# EasyEDA Pro project ProPrj_SRC_Robot2025_V1.0_2026-09-06.epro, board PCB-MOTOR
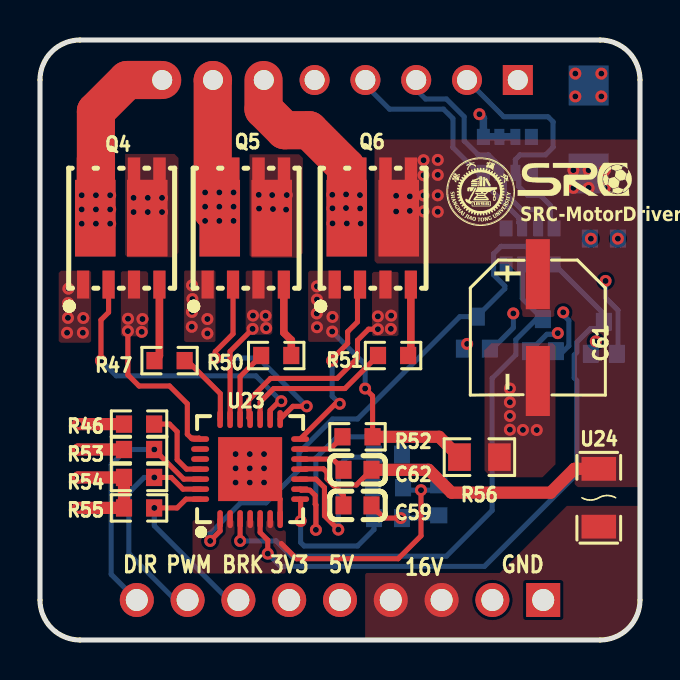
[diagram p11: board, top side]
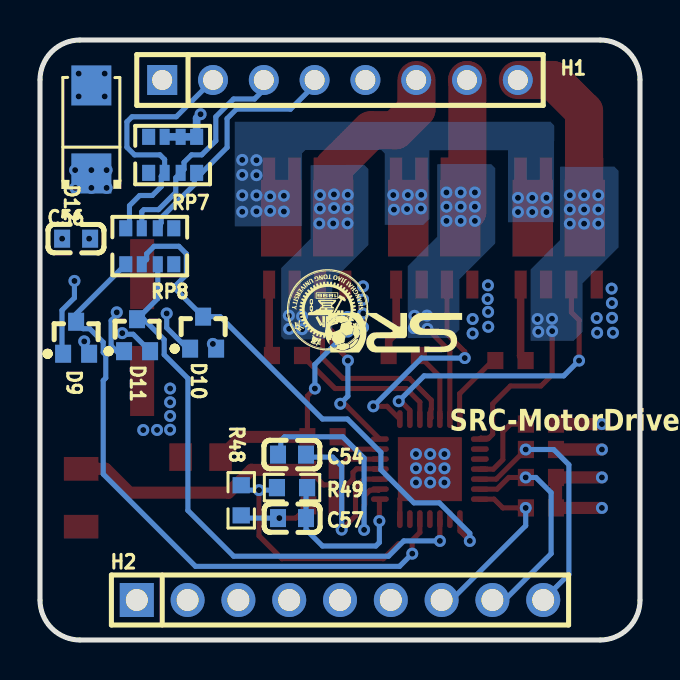
[diagram p12: board, bottom side, seen from below]

Outline 30 x 30 mm; copper layers: Top Layer, Mid-Layer 1, Mid-Layer 2, Bottom Layer. Coordinates in mm from the lower left corner of the outline.
Outline path: 0,28 0,2 arc(0.59,0.59) 2,0 28,0 arc(29.41,0.59) 30,2 30,28 arc(29.41,29.41) 28,30 2,30 arc(0.59,29.41) 0,28
Stack: Top Layer 0.035mm 外层铜厚1oz / Dielectric1 0.2104mm 7628 RC49% 8.6mil / Mid-Layer 1 0.0152mm 内层铜厚 / Dielectric2 1.065mm 1.1mm H/HOZ Copper / Mid-Layer 2 0.0152mm 内层铜厚 / Dielectric3 0.2104mm 7628 RC49% 8.6mil / Bottom Layer 0.035mm 外层铜厚1oz

## Design rules (mm)
net C56: Sheet3
net C58: Sheet3
net D8: Sheet3
net J10: Sheet3
net Q4: Sheet3
net Q5: Sheet3
net R47: Sheet3
net R50: Sheet3
net R51: Sheet3
net R52: Sheet3
net R56: Sheet3
net RP7: Sheet3
net RP8: Sheet3
net TP14: Sheet3
net TP15: Sheet3
net TP16: Sheet3
net TP17: Sheet3
net TP18: Sheet3
net TP19: Sheet3
net U24: Sheet3
net U23: Top Side Components
net R46: Top Side Components
net R53: Top Side Components
net R54: Top Side Components
net R55: Top Side Components
net R48: Top Side Components
net R49: Top Side Components
net C54: Top Side Components
net C55: Top Side Components
net C57: Top Side Components
net C60: Top Side Components
net C59: Top Side Components
template: 用户自定义配置
spacing Clearance (default): track to track 0.127, other pairs 0 to 0.254
track width Width (default): min 0.025, default 0.254, max 100
differential pair DiffPairsRouting (default): width min 0.381, default 0.381, max 0.381; gap min 0.254, default 0.254
via RoutingVias (default): diameter min 0.406, default 1.27, max 1.27; hole min 0.203, default 0.711, max 0.711

## Placement (name value [footprint] x y rotation side)
C54  100pF  [C0603]  17.4 9.27 180 bottom
C56  100pF  [C0603]  28.19 20.07 180 bottom
C57  100pF  [C0603]  17.4 6.1 0 bottom
C59  4.7uF  [C0603]  15.88 6.73 0 top
C61  220uF  [CAP-SMD_BD6.3-L6.6-W6.6-LS7.8-FD]  24.89 15.62 270 top
C62  100nF  [C0603]  15.88 8.51 0 top
D9  BAV99W,115  [SOT-323_L2.0-W1.3-P1.30-LS2.1-BR]  28.19 15.11 270 bottom
D10  BAV99W,115  [SOT-323_L2.0-W1.3-P1.30-LS2.1-BR]  21.84 15.37 270 bottom
D11  BAV99W,115  [SOT-323_L2.0-W1.3-P1.30-LS2.1-BR]  25.15 15.24 270 bottom
D12  SMAJ18A  [SMA_L4.3-W2.6-LS5.1-RD]  27.43 25.53 90 bottom
H1  PZ254V-11-08P  [HDR-TH_8P-P2.54-V-M]  15 28 180 bottom
H2  PZ254V-11-09P  [HDR-TH_9P-P2.54-V-M]  15 2 180 bottom
Q4  AON6884  [DFN-8_L5.5-W5.2-P1.27-LS6.0-BL-EP2]  4.06 19.43 0 top
Q5  AON6884  [DFN-8_L5.5-W5.2-P1.27-LS6.0-BL-EP2]  10.29 19.43 0 top
Q6  AON6884  [DFN-8_L5.5-W5.2-P1.27-LS6.0-BL-EP2]  16.64 19.43 0 top
R46  1K  [R0603]  4.95 10.8 180 top
R47  1K  [R0603]  6.48 13.97 180 top
R48  1K  [R0603]  19.94 6.98 270 bottom
R49  1K  [R0603]  17.4 7.62 180 bottom
R50  1K  [R0603]  11.81 14.22 0 top
R51  1K  [R0603]  17.65 14.22 0 top
R52  1K  [R0603]  15.88 10.16 0 top
R53  1K  [R0603]  4.95 9.53 180 top
R54  1K  [R0603]  4.95 8.13 180 top
R55  1K  [R0603]  4.95 6.6 180 top
R56  1K  [R0805]  21.97 9.14 0 top
RP7  5.1kΩ  [RES-ARRAY-SMD_0603-8P-L3.2-W1.6-BL]  23.37 24.26 0 bottom
RP8  330Ω  [RES-ARRAY-SMD_0603-8P-L3.2-W1.6-BL]  24.51 19.69 180 bottom
U23  A4931METTR-T  [WQFN-28_L5.0-W5.0-P0.50-BL-EP3.2]  10.51 8.55 0 top
U24  0466004.NRHF  [F1206]  27.94 7.11 270 top

## Footprints (pads in the part's own frame, mm; a bottom-side part is the same pattern mirrored in y, then rotated)
C0603
  rect 0.8x0.9 smd: 1(-0.7,0) 2(0.7,0)
CAP-SMD_BD6.3-L6.6-W6.6-LS7.8-FD
  rect 3.5x1.2 smd: 1(-2.67,0) 2(2.67,0)
DFN-8_L5.5-W5.2-P1.27-LS6.0-BL-EP2
  rect 0.61x1.397 smd: 1(-1.905,-1.66) 2(-0.635,-1.66) 3(0.635,-1.66) 4(1.905,-1.66)
  custom 2.028x4.953 smd: 5(1.3,1.66) 6(-1.3,1.66)
F1206
  rect 1.19x1.728 smd: 1(-1.445,0) 2(1.445,0)
HDR-TH_8P-P2.54-V-M
  rect 1.5x1.5 hole 1: 1(-8.89,0)
  round 1.5 hole 1: 2(-6.35,0) 3(-3.81,0) 4(-1.27,0) 5(1.27,0) 6(3.81,0) 7(6.35,0) 8(8.89,0)
HDR-TH_9P-P2.54-V-M
  rect 1.7x1.7 hole 1.1: 1(-10.16,0)
  round 1.7 hole 1.1: 2(-7.62,0) 3(-5.08,0) 4(-2.54,0) 5(0,0) 6(2.54,0) 7(5.08,0) 8(7.62,0) 9(10.16,0)
R0603
  rect 0.806x0.864 smd: 1(-0.753,0) 2(0.753,0)
R0805
  rect 1.133x1.377 smd: 1(-1,0) 2(1,0)
RES-ARRAY-SMD_0603-8P-L3.2-W1.6-BL
  rect 0.65x0.8 smd: 1(-1.2,-0.9) 4(1.2,-0.9) 5(1.2,0.9) 8(-1.2,0.9)
  rect 0.5x0.8 smd: 2(-0.4,-0.9) 3(0.4,-0.9) 6(0.4,0.9) 7(-0.4,0.9)
SMA_L4.3-W2.6-LS5.1-RD
  rect 2x2 smd: 1(-2.2,0) 2(2.2,0)
SOT-323_L2.0-W1.3-P1.30-LS2.1-BR
  rect 0.9x0.8 smd: 1(0.8,-0.65) 2(0.8,0.65) 3(-0.8,0)
WQFN-28_L5.0-W5.0-P0.50-BL-EP3.2
  oval 0.28x0.9 smd: 1(-1.502,-2.5) 2(-1.001,-2.5) 3(-0.5,-2.5) 4(0,-2.5) 5(0.5,-2.5) 6(1,-2.5) 7(1.501,-2.5) 15(1.501,2.5) 16(1,2.5) 17(0.5,2.5) 18(0,2.5) 19(-0.5,2.5) 20(-1.001,2.5) 21(-1.502,2.5)
  oval 0.9x0.28 smd: 8(2.5,-1.502) 9(2.5,-1.001) 10(2.5,-0.5) 11(2.5,0) 12(2.5,0.5) 13(2.5,1) 14(2.5,1.501) 22(-2.5,1.501) 23(-2.5,1) 24(-2.5,0.5) 25(-2.5,0) 26(-2.5,-0.5) 27(-2.5,-1.001) 28(-2.5,-1.502)
  rect 3.2x3.2 smd: 29(0,0)

## Nets
As in the schematic.

Pads without a net: RP7 4 5; RP8 4 5; U23 23 24

## Via types
v1: diameter 0.6, hole 0.3, Top Layer to Bottom Layer, 137 vias

## Routing (per net, layer and track width the routed paths; a pad name or vN(x,y) marks a point on that pad's centre or on a via; arc(x,y) is an arc through that point)
+3V3: length 6.1
  Top Layer w0.61: v1(1.91,8.13) R54.2 R55.2 v1(1.91,6.6)
+5V: length 4.6
  Bottom Layer w0.254: v1(25.89,15.34) 25.73,15.34 25.67,15.29 25.34,15.29 D11.2
  Bottom Layer w0.381: 23.77,25.16 22.17,25.16 22.17,26.09 v1(21.97,26.29)
  vias: v1(21.36,14.8) v1(27.79,14.93) v1(28.89,20.07)
GND: length 20.6
  Top Layer w0.254: U23.7 12.01,7.04 U23.29 ; C59.2 17.21,6.1 v1(18.03,6.1)
  Top Layer w0.61: R53.2 v1(1.91,9.53) ; R46.2 v1(1.91,10.8)
  Bottom Layer w0.254: 22.37,14.31 23.67,15.61 v1(23.67,16.33) ; R48.2 19.8,6.1 v1(18.03,6.1) ; v1(26.16,16.38) 26.16,16.26 26.44,15.97 26.44,14.71 26.05,14.31 25.67,14.31 ; v1(28.28,17.95) 28.28,17.11 28.9,16.49 28.9,14.37 D9.1
  vias: v1(9.78,9.3) v1(9.78,8.58) v1(9.78,7.87) v1(10.49,9.3) v1(10.49,8.58) v1(10.49,7.87) v1(11.2,9.3) v1(11.2,8.58) v1(11.2,7.87) v1(23.5,12.57) v1(23.5,11.89) v1(23.5,11.2) v1(23.5,10.52) v1(24.15,10.5) v1(24.84,10.5) v1(26.77,28.32) v1(26.77,27.18) v1(27.54,20.07) v1(28.07,28.32) v1(28.07,27.18)
A_OUT1: length 16.9
  Top Layer w0.254: v1(4.39,15.44) 4.39,13.26 4.95,12.7 6.48,12.7 7.37,11.81 7.37,10.29 7.59,10.06 7.62,10.09 7.96,10.09 U23.22
  Top Layer w1.905: v1(2.8,21.53) v1(2.8,22.24) 2.8,26.44 4.36,28 H1.8
  vias: v1(2.09,22.24) v1(2.09,21.53) v1(2.09,20.82) v1(2.8,20.82) v1(3.51,22.24) v1(3.51,21.53) v1(3.51,20.82) v1(4.4,16.06) v1(5.12,16.05) v1(5.09,15.41)
B_OUT1: length 12
  Top Layer w0.254: v1(10.63,15.56) 9.5,14.43 U23.20
  Top Layer w1.905: H1.7 8.64,27.99 8.64,21.44 Q5.6
  vias: v1(8.25,22.38) v1(8.25,21.67) v1(8.25,20.95) v1(8.97,22.38) v1(8.97,21.67) v1(8.97,20.95) v1(9.68,22.38) v1(9.68,21.67) v1(9.68,20.95) v1(10.65,16.22) v1(11.28,16.21) v1(11.31,15.59)
C_OUT1: length 18.3
  Top Layer w0.254: U23.18 10.45,11.1 10.45,11.54 10.43,11.56 10.43,11.99 11.53,13.08 14.86,13.08 15.88,14.1 15.88,14.99 16.43,15.54 v1(16.89,15.54)
  Top Layer w1.905: 11.18,28 11.18,26.54 12.23,25.49 13.45,25.49 15.3,23.64 v1(15.3,21.6)
  vias: v1(14.61,22.26) v1(14.62,21.59) v1(14.63,20.83) v1(15.3,22.28) v1(15.34,20.83) v1(16,22.25) v1(16.01,21.58) v1(16.04,20.82) v1(16.89,16.18) v1(17.54,15.56) v1(17.56,16.22)
HA_A1: length 26.9
  Top Layer w0.254: U23.1 9,5.45 v1(8.51,4.95)
  Bottom Layer w0.254: v1(8.51,4.95) 8.51,5.33 10.03,6.86 11.3,6.86 12.95,8.51 12.95,9.38 14.63,11.05 15.88,11.05 20.99,16.17 D10.3 23.24,17.56 23.24,17.7 22.68,18.26 22.68,19.31 23.06,19.69 24.29,19.69 24.67,19.31 24.67,19.03 RP8.2
HA_B1: length 28.9
  Top Layer w0.254: U23.3 v1(10.01,4.95)
  Bottom Layer w0.254: v1(10.01,4.95) 11.81,4.95 12.57,4.19 20.32,4.19 22.61,6.48 22.61,13.08 23.79,14.27 23.79,15.02 24.81,16.04 D11.3 24.11,17.08 RP8.3
HA_C1: length 31.9
  Top Layer w0.254: v1(11.39,4.32) 11.39,5 11.01,5.38 U23.5
  Bottom Layer w0.254: v1(11.39,4.32) 12.02,3.68 22.22,3.68 26.84,8.3 26.84,12.97 26.71,13.1 26.71,14.25 26.84,14.38 26.84,14.89 27.51,15.56 27.85,15.56 D9.3 28.19,16.3 25.71,18.78
MOTOR_BRK1: length 9.1
  Top Layer w0.254: U23.28 7.3,7.04 6.86,6.6 R55.1
  Bottom Layer w0.254: v1(5.72,6.6) 5.72,5.72 9.43,2 H2.7
MOTOR_DIR1: length 12.7
  Top Layer w0.254: R53.1 7.19,8.04 U23.26
  Bottom Layer w0.254: v1(5.72,9.53) 4.32,9.53 3.56,8.76 3.56,3.28 H2.9
MOTOR_PWM1: length 11.1
  Top Layer w0.254: R54.1 6.56,8.13 7.15,7.54 U23.27
  Bottom Layer w0.254: H2.8 6.76,2 4.44,4.32 4.44,7.37 5.21,8.13 v1(5.72,8.13)
$1N2: length 2.4
  Top Layer w0.254: C62.1 14.64,9.05 13.01,9.05
$1N4: length 12
  Top Layer w0.254: v1(19.05,7.49) 19.05,5.21 17.91,4.06 12.83,4.06 12.06,4.83
  Bottom Layer w0.254: R49.1 18.28,7.49 v1(19.05,7.49) 19.69,7.49 R48.1
$1N5: length 8.4
  Top Layer w0.254: U23.8 13.03,7.02 v1(13.03,5.95)
  Bottom Layer w0.254: v1(13.03,5.95) 13.03,4.87 13.21,4.7 15.88,4.7 16.7,5.52 C57.1 16.7,7.57 R49.2
$1N10: length 4
  Top Layer w0.254: R46.1 6.48,10.8 6.86,10.41 6.86,9.02 7.33,8.55 U23.25
$1N16: length 11.7
  Top Layer w0.254: v1(13.79,5.51) 13.79,6.76 13.76,6.79 13.76,7.23 13.5,7.49 13.06,7.49 U23.9
  Bottom Layer w0.254: v1(13.79,5.51) 13.79,9.1 14.86,10.16 17.78,10.16 17.96,9.98 17.96,9.41 C54.1
$1N17: length 9
  Top Layer w0.254: v1(14.92,5.52) 14.22,6.21 14.22,7.62 13.8,8.04 U23.10
  Bottom Layer w0.254: C54.2 16.57,9.14 15.37,9.14 14.92,8.69 v1(14.92,5.52)
$1N18: length 2.4
  Top Layer w0.254: R52.1 14.51,9.55 U23.13
$1N20: length 3.7
  Top Layer w0.254: R47.1 7.37,13.97 9.02,12.32 9.02,11.06 U23.21
$1N21: length 3.6
  Top Layer w0.254: U23.19 10.01,13.17 R50.1
$1N22: length 7.7
  Top Layer w0.254: U23.17 11.01,11.9 11.68,12.57 15.25,12.57 R51.1
$1N23: length 3.9
  Top Layer w0.381: R47.2 5.97,14.22 Q4.4
$1N24: length 3.7
  Top Layer w0.381: R50.2 12.56,14.99 12.19,15.37 Q5.4
$1N25: length 9.4
  Top Layer w0.254: U23.14 14.77,11.81 v1(14.99,11.81) ; Q6.2 15.88,17.64 15.88,15.91 15.38,15.41 15.38,14.83 14.6,14.05 v1(14.6,13.97)
  Bottom Layer w0.254: v1(14.6,13.97) 14.6,12.19 v1(14.99,11.81)
$1N26: length 11.2
  Top Layer w0.254: Q5.2 9.65,15.31 8.76,14.42 v1(8.76,14.1) ; U23.15 12.65,11.68 v1(13.34,11.68)
  Bottom Layer w0.254: v1(13.34,11.68) 10.92,14.1 v1(8.76,14.1)
$1N27: length 15
  Top Layer w0.254: U23.16 11.51,11.48 11.96,11.94 v1(12.06,11.94) ; Q4.2 3.43,16.38 3.05,16 v1(3.05,13.97)
  Bottom Layer w0.254: v1(3.05,13.97) 3.81,13.21 10.79,13.21 v1(12.06,11.94)
$1N28: length 10.9
  Top Layer w0.254: v1(16.26,12.57) 16.63,12.2 R52.2
  Top Layer w0.61: R52.2 19.96,10.16 R56.1
  Bottom Layer w0.254: v1(16.26,12.57) 16.26,13.77 v1(14.61,15.42)
  vias: v1(1.42,17.57) v1(1.41,16.85) v1(1.4,16.11) v1(1.35,15.36) v1(2.14,15.36) v1(2.16,16.1) v1(7.6,17.73) v1(7.62,17.05) v1(7.59,16.41) v1(7.59,15.66) v1(8.37,16.05) v1(8.37,15.33) v1(13.85,17.68) v1(13.85,17.02) v1(13.84,16.33) v1(13.85,15.64) v1(14.62,16.15)
$1N30: length 18
  Top Layer w0.254: 14.65,7.75 15.18,7.23 C59.1 ; 14.65,7.75 15.82,7.75 C62.2 ; 14.65,7.75 14.35,8.05 14.35,8.38 14.17,8.56 13.28,8.56 13.26,8.55 U23.11
  Top Layer w0.61: U24.1 26.72,8.56 25.53,7.37 20.57,7.37 19.43,8.51 C62.2
  vias: v1(4.68,22.11) v1(4.68,21.4) v1(5.39,22.11) v1(5.39,21.4) v1(6.1,22.11) v1(6.1,21.4) v1(10.94,22.26) v1(10.95,21.57) v1(11.61,22.25) v1(11.65,21.55) v1(12.34,22.25) v1(12.3,21.52) v1(17.81,22.21) v1(17.81,21.43) v1(18.49,22.18) v1(18.49,21.46) v1(19.18,23.99) v1(19.18,23.24) v1(19.18,22.23) v1(19.18,21.43) v1(19.89,24) v1(19.89,23.25) v1(19.89,22.23) v1(19.89,21.41) v1(26.67,23.5) v1(26.67,22.61) v1(27.43,23.5) v1(27.43,22.61) v1(28.24,23.5) v1(28.23,22.61)
$1N34: length 3.6
  Top Layer w0.381: Q6.4 18.54,14.36 R51.2
$1N40: length 13.2
  Bottom Layer w0.254: H1.2 23.19,26.16 25.4,26.16 25.65,25.91 25.65,24.64 25.27,24.26 24,24.26 23.77,24.02 RP7.6 23.94,23.19 23.94,22.67 24.38,22.22 25.02,22.22 25.53,21.72 25.53,20.77 25.71,20.58
$1N41: length 11.3
  Bottom Layer w0.254: H1.3 18.81,27.52 19.27,27.05 20.32,27.05 21.21,26.16 21.21,24.96 21.91,24.26 22.42,24.26 22.8,23.88 22.8,23.53 RP7.7 23.21,23.11 23.21,22.38 24.08,21.52 24.81,21.52 24.91,21.41 24.91,20.58
$1N42: length 12.4
  Bottom Layer w0.254: H1.4 16.27,27.75 17.47,26.54 20.17,26.54 20.65,26.07 20.65,24.62 21.91,23.36 RP7.8 22.17,23.1 22.29,22.98 22.29,22.77 23.94,21.11 23.94,20.86 23.98,20.82 23.98,20.71 24.11,20.58

## Copper pours and planes (outline as drawn; the poured copper is in the pictures)
+3V3 on Mid-Layer 2: 0.01,12.21 13.64,12.21 13.64,0.01 0.01,0.01
+5V on Mid-Layer 2: 0.01,29.99 29.99,29.99 29.99,0.01 0.01,0.01
GND on Top Layer: 22.23,14.84 25.77,14.84 25.77,8.14 22.23,8.14
GND on Mid-Layer 1: 0.01,29.99 29.99,29.99 29.99,0.01 0.01,0.01
VBAT on Top Layer: 16.36,3.25 16.36,-1.52 29.46,-1.52 31.24,0.25 31.24,6.6 26.38,6.6 23.03,3.25
A_OUT1 on Top Layer: 4.04,18.43 5.41,18.43 5.41,15.18 4.04,15.18
A_OUT1 on Bottom Layer: 1.07,23.67 5.47,23.67 5.47,14.96 1.07,14.96
B_OUT1 on Top Layer: 10.29,18.47 11.62,18.47 11.62,15.27 10.29,15.27
B_OUT1 on Bottom Layer: 7.24,23.79 11.61,23.79 11.61,15.1 7.24,15.1
C_OUT1 on Top Layer: 16.6,18.41 17.93,18.41 17.93,15.2 16.6,15.2
C_OUT1 on Bottom Layer: 13.58,23.76 17.94,23.76 17.94,15.03 13.58,15.03
$1N4 on Top Layer: 7.73,5.89 12.19,5.89 12.19,3.43 7.73,3.43
$1N28 on Top Layer: 13.41,18.47 15,18.47 15,14.91 13.41,14.91
$1N28 on Top Layer: 7.21,18.48 8.78,18.48 8.78,14.9 7.21,14.9
$1N28 on Top Layer: 0.93,18.46 2.56,18.46 2.56,14.87 0.93,14.87
$1N28 on Mid-Layer 1: 0.01,18.54 19.05,18.54 19.05,13.34 0.01,13.34
$1N30 on Top Layer: 16.82,24.91 16.82,18.99 16.89,18.92 23.43,18.92 24.13,18.23 24.13,16.26 26.52,16.26 26.84,15.94 26.84,7.84 26.92,7.75 30,7.75 30,24.92 16.84,24.92
$1N30 on Top Layer: 10.48,24.28 13.14,24.28 13.14,19.11 10.48,19.11
$1N30 on Top Layer: 4.26,24.3 6.92,24.3 6.92,19.13 4.26,19.13
$1N30 on Bottom Layer: 4.29,25.91 20.26,25.91 20.26,20.68 4.29,20.68

Small or netless copper shapes (teardrops, artwork), in the pictures only: 12 on Mid-Layer 1, 12 on Mid-Layer 2

## Text on the board
Bottom Silkscreen Layer: SRC-MotorDriver
Top Silkscreen Layer: DIR | PWM | BRK | 3V3 | 5V | 16V | GND | SRC-MotorDriver
